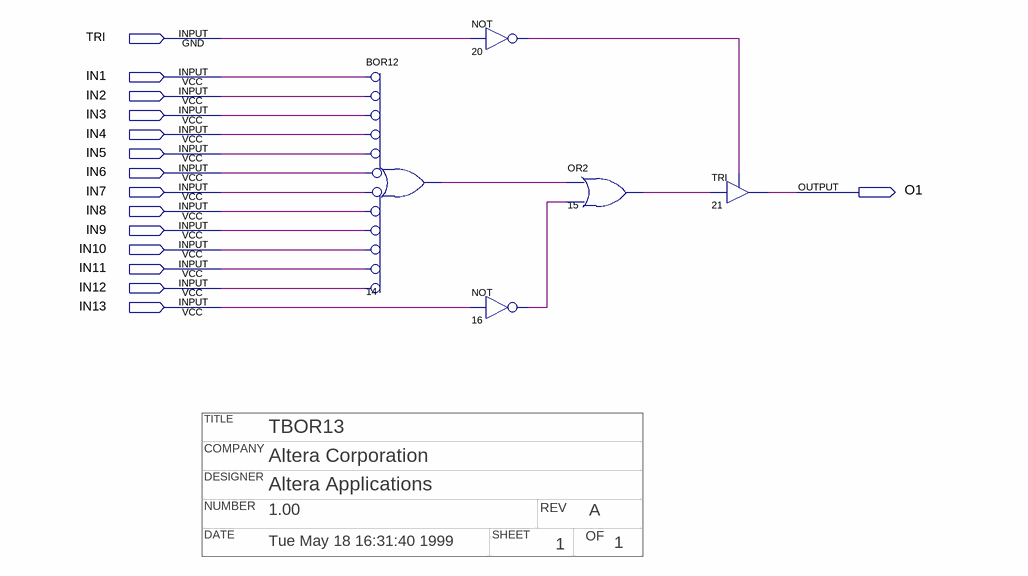
[diagram p0: schematic sheet]
// Quartus schematic tbor13.bdf as structural Verilog: 5 symbols, 15 pins
// Title block: TITLE: TBOR13; COMPANY: Altera Corporation; DESIGNER: Altera Applications; NUMBER: 1.00; REV: A; DATE: Tue May 18 16:31:40 1999; SHEET: 1; OF: 1
module tbor13 (
  input  TRI,
  input  IN1,
  input  IN2,
  input  IN3,
  input  IN4,
  input  IN5,
  input  IN6,
  input  IN7,
  input  IN8,
  input  IN9,
  input  IN10,
  input  IN11,
  input  IN12,
  input  IN13,
  output O1
);

  wire n14_out, n15_out, n16_out, n20_out;

  or u_14 (n14_out, ~IN1, ~IN2, ~IN3, ~IN4, ~IN5, ~IN6, ~IN7, ~IN8, ~IN9, ~IN10, ~IN11, ~IN12);  // BOR12
  not u_20 (n20_out, TRI);
  not u_16 (n16_out, IN13);
  or u_15 (n15_out, n14_out, n16_out);
  TRI u_21 (.IN(n15_out), .OE(n20_out), .OUT(O1));
endmodule
